# EasyEDA Pro project ProPrj_Y车Y形板_2025-09-30.epro, schematic Schematic10
Board Name: XW; Create Date: 2025-05-23; Page Name: P1; Project Name: Y车Y形板; Schematic Name: Schematic10; Update Date: 2025-05-23; Company: 嘉立创EDA; Page Size: A4; Version: V1.0
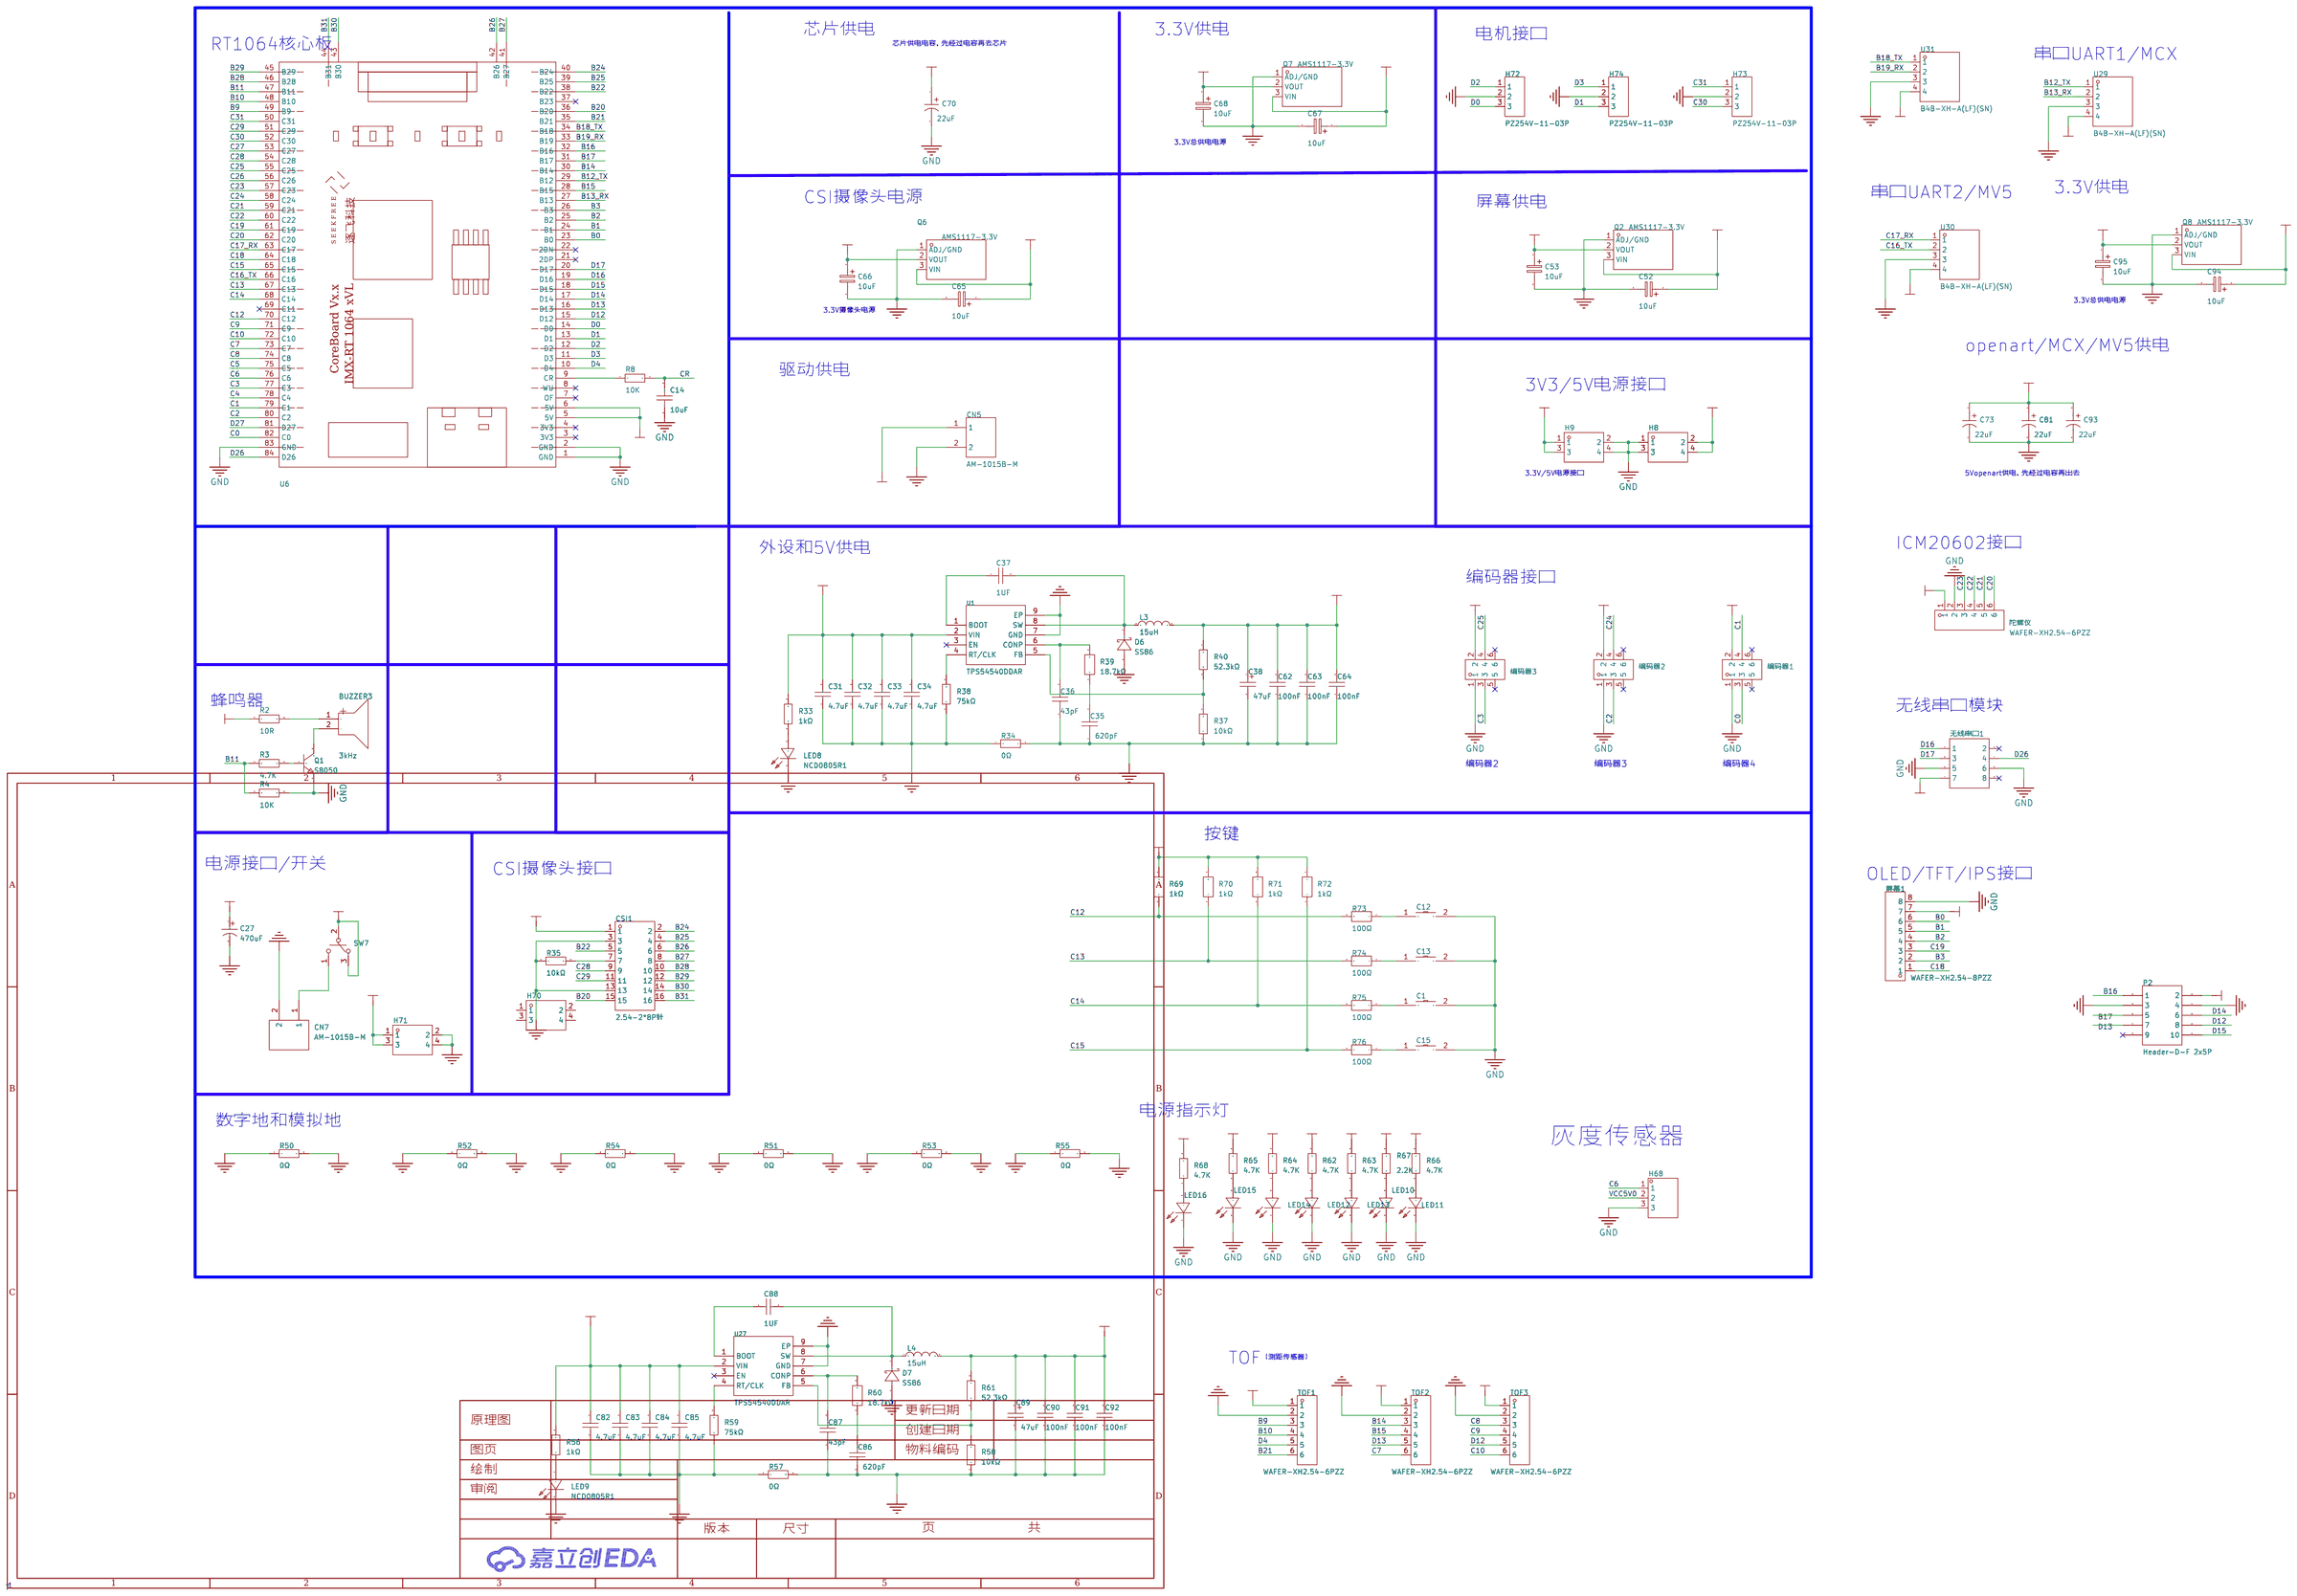
[diagram p0: schematic sheet]

## Parts
BUZZER3  3kHz  [BUZ-TH_BD9.0-P5.00-D0.6-FD]
C1  TS-1101-C-W  [SW-SMD_L6.0-W3.3-LS8.0]
C12  TS-1101-C-W  [SW-SMD_L6.0-W3.3-LS8.0]
C13  TS-1101-C-W  [SW-SMD_L6.0-W3.3-LS8.0]
C14  10uF  [C0805]
C15  TS-1101-C-W  [SW-SMD_L6.0-W3.3-LS8.0]
C27  470uF  [CAP-TH_BD10.0-P5.00-D1.0-FD]
C31  4.7uF  [C0805]
C32  4.7uF  [C0805]
C33  4.7uF  [C0805]
C34  4.7uF  [C0805]
C35  620pF  [C0805]
C36  43pF  [C0805]
C37  1UF  [C0805]
C38  47uF  [CAP-SMD_L3.5-W2.8-R-RD]
C52  10uF  [CAP-SMD_L3.5-W2.8-R-RD]
C53  10uF  [CAP-SMD_L3.5-W2.8-R-RD]
C62  100nF  [C0805]
C63  100nF  [C0805]
C64  100nF  [C0805]
C65  10uF  [CAP-SMD_L3.5-W2.8-R-RD]
C66  10uF  [CAP-SMD_L3.5-W2.8-R-RD]
C67  10uF  [CAP-SMD_L3.5-W2.8-R-RD]
C68  10uF  [CAP-SMD_L3.5-W2.8-R-RD]
C70  22uF  [CAP-SMD_L3.2-W1.6]
C73  22uF  [CAP-SMD_L3.2-W1.6]
C81  22uF  [CAP-SMD_L3.2-W1.6]
C82  4.7uF  [C0805]
C83  4.7uF  [C0805]
C84  4.7uF  [C0805]
C85  4.7uF  [C0805]
C86  620pF  [C0805]
C87  43pF  [C0805]
C88  1UF  [C0805]
C89  47uF  [CAP-SMD_L3.5-W2.8-R-RD]
C90  100nF  [C0805]
C91  100nF  [C0805]
C92  100nF  [C0805]
C93  22uF  [CAP-SMD_L3.2-W1.6]
C94  10uF  [CAP-SMD_L3.5-W2.8-R-RD]
C95  10uF  [CAP-SMD_L3.5-W2.8-R-RD]
CN5  AM-1015B-M  [CONN-TH_AM-1015B-M]
CN7  AM-1015B-M  [CONN-TH_AM-1015B-M]
CSI1  2.54-2*8P针  [HDR-TH_16P-P2.54-V-M-R2-C8-S2.54]
D6  SS86  [SMC_L6.9-W5.9-LS7.9-RD]
D7  SS86  [SMC_L6.9-W5.9-LS7.9-RD]
H8  -  [HDR-TH_4P-P2.54-V-M-R2-C2-S2.54-1]
H9  -  [HDR-TH_4P-P2.54-V-M-R2-C2-S2.54-1]
H68  77311-102-03LF  [HDR-TH_3P-P2.54-V-M-1]
H70  -  [HDR-TH_4P-P2.54-V-M-R2-C2-S2.54-1]
H71  -  [HDR-TH_4P-P2.54-V-M-R2-C2-S2.54-1]
H72  PZ254V-11-03P  [HDR-TH_3P-P2.54-V-M]
H73  PZ254V-11-03P  [HDR-TH_3P-P2.54-V-M]
H74  PZ254V-11-03P  [HDR-TH_3P-P2.54-V-M]
L3  15uH  [IND-SMD_L7.1-W6.6]
L4  15uH  [IND-SMD_L7.1-W6.6]
LED8  NCD0805R1  [LED0805-R-RD]
LED9  NCD0805R1  [LED0805-R-RD]
LED10  NCD0805R1  [LED0805-RD]
LED11  NCD0805R1  [LED0805-RD]
LED12  NCD0805R1  [LED0805-RD]
LED13  NCD0805R1  [LED0805-RD]
LED14  NCD0805R1  [LED0805-RD]
LED15  NCD0805R1  [LED0805-RD]
LED16  NCD0805R1  [LED0805-RD]
P2  Header-D-F 2x5P  [HDR2X5-F]
Q1  S8050  [SOT-23-3_L2.9-W1.3-P1.90-LS2.4-BR]
Q2  AMS1117-3.3V  [SOT-89-3_L4.5-W2.5-P1.50-LS4.2-BR]
Q6  AMS1117-3.3V  [SOT-89-3_L4.5-W2.5-P1.50-LS4.2-BR]
Q7  AMS1117-3.3V  [SOT-89-3_L4.5-W2.5-P1.50-LS4.2-BR]
Q8  AMS1117-3.3V  [SOT-89-3_L4.5-W2.5-P1.50-LS4.2-BR]
R2  10R  [R0805]
R3  4.7K  [R0805]
R4  10K  [R0805]
R8  10K  [R0805]
R33  1kΩ  [R0805]
R34  0Ω  [R0805]
R35  10kΩ  [R0603]
R37  10kΩ  [R0805]
R38  75kΩ  [R0805]
R39  18.7kΩ  [R0805]
R40  52.3kΩ  [R0805]
R50  0Ω  [R0805]
R51  0Ω  [R0805]
R52  0Ω  [R0805]
R53  0Ω  [R0805]
R54  0Ω  [R0805]
R55  0Ω  [R0805]
R56  1kΩ  [R0805]
R57  0Ω  [R0805]
R58  10kΩ  [R0805]
R59  75kΩ  [R0805]
R60  18.7kΩ  [R0805]
R61  52.3kΩ  [R0805]
R62  4.7K  [R0805]
R63  4.7K  [R0805]
R64  4.7K  [R0805]
R65  4.7K  [R0805]
R66  4.7K  [R0805]
R67  2.2K  [R0805]
R68  4.7K  [R0805]
R69  1kΩ  [R0805]
R70  1kΩ  [R0805]
R71  1kΩ  [R0805]
R72  1kΩ  [R0805]
R73  100Ω  [R0805]
R74  100Ω  [R0805]
R75  100Ω  [R0805]
R76  100Ω  [R0805]
SW7  MT-0-103-A101-M200-RS+PJ  [SW-TH_MT-0-103-A101-M200-RS]
TOF1  WAFER-XH2.54-6PZZ  [CONN-TH_XH2.54-6P]
TOF2  WAFER-XH2.54-6PZZ  [CONN-TH_XH2.54-6P]
TOF3  WAFER-XH2.54-6PZZ  [CONN-TH_XH2.54-6P]
U1  TPS54540DDAR  [SOIC-8_L4.9-W3.9-P1.27-LS6.0-BL-EP]
U6  -  [AUFE_RT1064]
U27  TPS54540DDAR  [SOIC-8_L4.9-W3.9-P1.27-LS6.0-BL-EP]
U29  B4B-XH-A(LF)(SN)  [CONN-TH_B4B-XH-A-LF-SN]
U30  B4B-XH-A(LF)(SN)  [CONN-TH_B4B-XH-A-LF-SN]
U31  B4B-XH-A(LF)(SN)  [CONN-TH_B4B-XH-A-LF-SN]
屏幕1  WAFER-XH2.54-8PZZ  [CONN-TH_8P-P2.50-XH2.54-8P]
无线串口1  -  [HDR-TH_8P-P2.54-V-F-R2-C4-S2.54-1]
编码器1  67997-206HLF  [HDR-TH_6P-P2.54-V-M-R2-C3-S2.54-1]
编码器2  67997-206HLF  [HDR-TH_6P-P2.54-V-M-R2-C3-S2.54-1]
编码器3  67997-206HLF  [HDR-TH_6P-P2.54-V-M-R2-C3-S2.54-1]
陀螺仪  WAFER-XH2.54-6PZZ  [CONN-TH_XH2.54-6P]

## Library data of the parts
BUZZER3 = HNB09A03: 驱动方式:有源(内含驱动线路);构造类型:电磁式;频率:3kHz;声压(SPL):85dB@10cm;; LCSC Part Name: 电磁式有源一体蜂鸣器HNB09A03; Supplier Part: C96102; Manufacturer: 华能; Supplier Footprint: 插件,D=9mm; JLCPCB Part Class: 扩展库; Datasheet: https://atta.szlcsc.com/upload/public/pdf/source/20170522/1495448326172.pdf; Supplier: LCSC; Oscillator Circuit: 有源(内含驱动线路); Technology Type: 电磁式; Operating Voltage: 1.5V~4.5V; Current Consumption: 30mA; Sound Pressure Level (SPL): 85dB@10cm; Diameter (φD): 9mm; Height: 5.5mm; Operating Temperature: -20℃~+70℃
C1 C12 C13 C15 = TS-1101-C-W: 触点电流:50mA;额定电压(DC):12V;绝缘电阻:-;电路结构:单刀单掷;安装方式:立贴;按钮形状:矩形按钮;按钮/盖帽颜色:白色;带灯:无;作用力:260gf;机械寿命:50000;工作温度:-30℃~+85℃;开关长度:6mm;开关宽度:3.6mm;开关高度:2.5mm;带支架:否;; LCSC Part Name: TS-1101-C-W 一型3*6*2.5有白ZD b拉伸白色按键 卷装; Supplier Part: C318938; Manufacturer: XKB Connectivity(中国星坤); Supplier Footprint: SMD; JLCPCB Part Class: Extended Part; Datasheet: https://atta.szlcsc.com/upload/public/pdf/source/20200227/C318938_C2E53B1EEDE37D980A33616AC086DE53.pdf; Supplier: LCSC; Contact Current: 50mA; Voltage Rating (DC): 12V; Circuit: 单刀单掷; Mounting Style: 立贴; Actuator Style: 矩形按钮; Actuator/Cap Color: 白色; With Lamp: 无; Operating Force: 260gf; Mechanical Life: 50000; Operating Temperature: -30℃~+85℃; Switch Length: 6mm; Switch Width: 3.6mm; Switch Height: 2.5mm; Strike Gundam: 否
C14 = CAP_0805: Supplier Footprint: 0805
C27 = KM477M050G20RR0VH2FP0: 容值:470uF;精度:±20%;额定电压:50V;电容体直径:10mm;电容体长度:20mm;脚间距:5mm;工作寿命:2000hrs@105℃;; LCSC Part Name: 470uF ±20% 50V; Supplier Part: C34642; Manufacturer: CX(承兴); Supplier Footprint: 直插,D10xL20mm; JLCPCB Part Class: Extended Part; Datasheet: https://atta.szlcsc.com/upload/public/pdf/source/20211027/06D6BA3719C264B639DC286D935D03EA.pdf; Supplier: LCSC; Tolerance: ±20%; Rated Voltage: 50V; φD: 10mm; L: 20mm; Lead Spacing: 5mm; Lifetime @ Temp: 2000hrs@105℃
C31-C34 C82-C85 = CL21A475KAQNNNE: 容值:4.7uF;精度:±10%;额定电压:25V;材质(温度系数):X5R;; LCSC Part Name: 4.7uF ±10% 25V; Supplier Part: C1779; Manufacturer: SAMSUNG(三星); Supplier Footprint: 0805; JLCPCB Part Class: 基础库; Datasheet: https://atta.szlcsc.com/upload/public/pdf/source/20160218/1457707763339.pdf; Supplier: LCSC; Tolerance: ±10%; Voltage Rated: 25V; Temperature Coefficient: X5R
C35 C86 = CC0805FRNPO9BN621: 容值:620pF;精度:±1%;额定电压:50V;材质(温度系数):NP0;; LCSC Part Name: 620pF ±1% 50V; Supplier Part: C541568; Manufacturer: YAGEO(国巨); Supplier Footprint: 0805; JLCPCB Part Class: 扩展库; Datasheet: https://atta.szlcsc.com/upload/public/pdf/source/20200615/C541568_5E136F40411BB8460285BCFF982D8614.pdf; Supplier: LCSC; Tolerance: ±1%; Voltage Rated: 50V; Temperature Coefficient: NP0
C36 C87 = 0805CG430J500NT: 容值:43pF;精度:±5%;额定电压:50V;材质(温度系数):C0G;; LCSC Part Name: 43pF ±5% 50V; Supplier Part: C502147; Manufacturer: FH(风华); Supplier Footprint: 0805; JLCPCB Part Class: 扩展库; Datasheet: https://atta.szlcsc.com/upload/public/pdf/source/20200305/C486355_26A10D38EF8C2A5C37091D0039909270.pdf; Supplier: LCSC; Tolerance: ±5%; Voltage Rated: 50V; Temperature Coefficient: C0G
C37 C88 = CC0805KRX7R9BB104: 容值:100nF;精度:±10%;额定电压:50V;材质(温度系数):X7R;; LCSC Part Name: 100nF ±10% 50V; Supplier Part: C49678; Manufacturer: YAGEO(国巨); Supplier Footprint: 0805; JLCPCB Part Class: 基础库; Datasheet: https://atta.szlcsc.com/upload/public/pdf/source/20180224/C181747_15194369449651363981.pdf; Supplier: LCSC; Tolerance: ±10%; Voltage Rated: 50V; Temperature Coefficient: X7R
C38 C89 = CA45-B010K476T: 容值:47uF;精度:±10%;额定电压:10V;等效串联电阻:1Ω@100kHz;; LCSC Part Name: 47uF ±10% 10V; Supplier Part: C123253; Manufacturer: 湘怡中元/湘江; Supplier Footprint: CASE-B-3528; JLCPCB Part Class: 扩展库; Datasheet: https://atta.szlcsc.com/upload/public/pdf/source/20181017/C123253_E44F021CD80332E438026884F943F9F2.pdf; Supplier: LCSC; Tolerance: ±10%; Rated Voltage: 10V; Equivalent Series Resistance(ESR): 1Ω@100kHz; Operating Temperature: -55℃~+125℃
C52 C53 C65-C68 C94 C95 = CA45-B-16V-10μF-K: 容值:10uF;精度:±10%;额定电压:16V;等效串联电阻:2.8Ω@100kHz;; LCSC Part Name: 10uF ±10% 16V; Supplier Part: C503899; Manufacturer: TORCH(火炬); Supplier Footprint: CASE-B-3528; JLCPCB Part Class: 扩展库; Datasheet: https://atta.szlcsc.com/upload/public/pdf/source/20200527/C503899_E68A547A52C2BA3860090FD06476D5DC.pdf; Supplier: LCSC; Tolerance: ±10%; Rated Voltage: 16V; Equivalent Series Resistance(ESR): 2.8Ω@100kHz; Operating Temperature: -55℃~+125℃
C62-C64 C90-C92 = 0805B104K500NT: 容值:100nF;精度:±10%;额定电压:50V;材质(温度系数):X7R;; LCSC Part Name: 100nF ±10% 50V; Supplier Part: C38141; Manufacturer: FH(风华); Supplier Footprint: 0805; JLCPCB Part Class: 扩展库; Datasheet: https://atta.szlcsc.com/upload/public/pdf/source/20200305/C486355_26A10D38EF8C2A5C37091D0039909270.pdf; Supplier: LCSC; Tolerance: ±10%; Voltage Rated: 50V; Temperature Coefficient: X7R
C70 C73 C81 C93 = CA45-A-16V-22uF-K: 容值:22uF;精度:±10%;额定电压:16V;等效串联电阻:6Ω@100kHz;; LCSC Part Name: 22uF ±10% 16V; Supplier Part: C782264; Manufacturer: CEC(振华新云); Supplier Footprint: CASE-A-3216; JLCPCB Part Class: 扩展库; Datasheet: https://atta.szlcsc.com/upload/public/pdf/source/20200909/C782264_D6D9C4EF3B25E81633C26A9294FBB820.pdf; Supplier: LCSC; Tolerance: ±10%; Rated Voltage: 16V; Equivalent Series Resistance(ESR): 6Ω@100kHz; Operating Temperature: -55℃~+125℃
CN5 CN7 = AM-1015B-M: 类别:-;类型1:-;; LCSC Part Name: AMASS(艾迈斯)电源连接器公头AM-1015B-M; Supplier Part: C90631; Manufacturer: AMASS(艾迈斯); JLCPCB Part Class: 扩展库; Datasheet: https://atta.szlcsc.com/upload/public/pdf/source/20161217/1481939174683.pdf; Supplier: LCSC; Brand: 艾迈斯; Type: T行插头; RatedVoltage: DC 500V; InterfaceType: 双公头; MetalMaterial: 铜镀金; InsulationMaterial: PA; RatedCurrent: 25A; RecommendedWireGauge: 12AWG; FlameRetardantGrade: UL94 V0; contact resistance: 0.45mΩ
CSI1 = 2.54-2*8P针_C779499: 圆针/方针:-;额定电流:-;额定电压:-;配合针长度:-;塑高:-;触头材质:-;; LCSC Part Name: 双排直插 2*8排针 2.54mm; Supplier Part: C779499; Manufacturer: BOOMELE(博穆精密); Supplier Footprint: 插件,P=2.54mm; JLCPCB Part Class: 扩展库; Datasheet: https://atta.szlcsc.com/upload/public/pdf/source/20221201/C605E3BE9C0F7226363017EFD1BDE852.pdf; Supplier: LCSC
D6 D7 = SS86: 二极管配置:独立式;正向压降(Vf):700mV@8A;直流反向耐压(Vr):60V;平均整流电流(Io):8A;; LCSC Part Name: 电压:60V 电流:8A; Supplier Part: C698827; Manufacturer: YANGJIE(扬杰); Supplier Footprint: SMC(DO-214AB); JLCPCB Part Class: 扩展库; Datasheet: https://atta.szlcsc.com/upload/public/pdf/source/20200709/C698826_5E937841B5131ACF209993117D465D40.pdf; Supplier: LCSC; Diode Configuration: 独立式; Forward Voltage (Vf@If): 700mV@8A; Reverse Voltage (Vr): 60V; Average Rectified Current (Io): 8A; Reverse Leakage Current (Ir): 200uA@60V
H8 H9 H70 H71 = HDR-M_2.54_2x2: Supplier Part: C160338; Supplier Footprint: 插件,P=2.54mm
H68 = 77311-102-03LF: 排数:单排;总PIN位数:-;间距:2.54mm;插针结构:-;行距:-;安装类型:直插;圆针/方针:方针;额定电流:-;额定电压:-;配合针长度:-;塑高:2.54mm;触头材质:磷青铜;触头镀层:-;颜色:黑色;; LCSC Part Name: 2.54mm 直插 方针; Supplier Part: C180248; Manufacturer: Amphenol; Supplier Footprint: 直插,P=2.54mm; JLCPCB Part Class: Extended Part; Datasheet: https://atta.szlcsc.com/upload/public/pdf/source/20180329/C180248_62E264527695F7ED58561BB828D45E42.pdf; Supplier: LCSC; Number of Rows: 单排; Pitch: 2.54mm; Mounting Type: 直插; Circluar Pins/Square Pins: 方针; Insulation Height: 2.54mm; Contact Material: 磷青铜; Color: 黑色
H72-H74 = PZ254V-11-03P: 插针结构:1x3P;间距:2.54mm;行距:-;圆针/方针:方针;安装方式:直插;排数:单排;总PIN位数:3P;额定电流:3A;额定电压:250V;配合针长度:6mm;塑高:2.5mm;端接针长度:3mm;工作温度:-40℃~+105℃;颜色:黑色;; LCSC Part Name: 1x3P 间距:2.54mm 方针 直插; Supplier Part: C2937625; Manufacturer: XFCN(兴飞); Supplier Footprint: 插件,P=2.54mm; JLCPCB Part Class: 扩展库; Datasheet: https://atta.szlcsc.com/upload/public/pdf/source/20200309/C492402_8335C3D49C4E4C618838D59BB1D024C1.pdf; Supplier: LCSC; Pin Structure: 1x3P; Pitch: 2.54mm; Circluar Pins/Square Pins: 方针; Mounting Type: 直插; Number of Rows: 单排; Number of Pins: 3P; Current Rating: 3A; Voltage Rating (Max): 250V; Length of Mating Pin: 6mm; Insulation Height: 2.5mm; Length of End Connection Pin: 3mm; Operating Temperature: -40℃~+105℃; Color: 黑色
L3 L4 = PSPMAQ0605H-150M-ANP: 电感值:15uH;精度:±20%;额定电流:3.5A;饱和电流(Isat):6A;; LCSC Part Name: 15uH ±20% 6A; Supplier Part: C726343; Manufacturer: PROD(谱罗德); Supplier Footprint: SMD,6.6x7.1mm; JLCPCB Part Class: 扩展库; Datasheet: https://atta.szlcsc.com/upload/public/pdf/source/20200923/C726334_6740F679044ED6FAED7178765ABA7BEE.pdf; Supplier: LCSC; Tolerance: ±20%; Rated Current: 3.5A; Saturation Current (Isat): 6A; DC Resistance (DCR): 87mΩ; Ratings: AEC-Q200
LED8 LED9 = NCD0805R1: 灯头类型:-;发光颜色:红色;正向电压(VF):1.6V~2.6V;功率:65mW;正向电流:20mA;主波长:615nm~630nm;二极管配置:独立二极管;透镜颜色:无色透明;色温:-;发光强度:67mcd~195mcd;发光角度:130°;载带方式:-;工作温度:-30℃~+85℃;; Supplier Part: C84256; Manufacturer: 国星光电; Supplier Footprint: 0805; JLCPCB Part Class: 基础库; Datasheet: https://atta.szlcsc.com/upload/public/pdf/source/20200820/C84256_F0A75A43B3EAD75808600A0514C76B99.pdf; Supplier: LCSC; Emitted Color: 红色; Forward Voltage (VF): 1.6V~2.6V; Power Dissipation: 65mW; Forward Current: 20mA; Dominant Wavelength: 615nm~630nm; Diode Configuration: 独立二极管; Lens Color: 无色透明; Luminous Intensity: 67mcd~195mcd; Viewing Angle: 130°; Operating Temperature: -30℃~+85℃
LED10-LED16 = NCD0805R1: 发光颜色:红灯;; LCSC Part Name: 红灯; Supplier Part: C84256; Manufacturer: 国星光电; Supplier Footprint: 0805; JLCPCB Part Class: Basic Part; Datasheet: https://atta.szlcsc.com/upload/public/pdf/source/20200820/C84256_F0A75A43B3EAD75808600A0514C76B99.pdf; Supplier: LCSC; Emitted Color: 红灯
P2 = Header-D-F 2x5P: Revision: V1.0
Q1 = S8050_C2762211: 晶体管类型:NPN;集射极击穿电压(Vceo):25V;集电极电流(Ic):500mA;功率(Pd):300mW;集电极-发射极饱和电压(VCE(sat)@Ic,Ib):600mV@500mA,50mA;直流电流增益(hFE@Ic,Vce):120@50mA,1V;特征频率(fT):150MHz;工作温度:-55℃~+150℃@(Tj);; Supplier Part: C2762211; Manufacturer: 晶导微电子; Supplier Footprint: SOT-23; JLCPCB Part Class: Extended Part; Datasheet: https://atta.szlcsc.com/upload/public/pdf/source/20210521/C2762211_5AC5D762C14CC7F013712CBEE509B0DC.pdf; Supplier: LCSC; Transistor Type: NPN; Collector-Emitter Breakdown Voltage (Vceo): 25V; Collector Current (Ic): 500mA; Power Dissipation (Pd): 300mW; Collector-Emitter Saturation Voltage (VCE(sat)@Ic,Ib): 600mV@500mA,50mA; DC Current Gain (hFE@Ic,Vce): 120@50mA,1V; Transition Frequency (fT): 150MHz; Operating Temperature: -55℃~+150℃@(Tj)
Q2 Q6-Q8 = AMS1117-3.3V_C5120796: 输出类型:固定;最大输入电压:18V;输出电压:3.3V;最大输出电流:1A;输出极性:正极;; LCSC Part Name: 输入18V 输出3.3V 1A; Supplier Part: C5120796; Manufacturer: MSKSEMI(美森科); Supplier Footprint: SOT-89; JLCPCB Part Class: 扩展库; Datasheet: https://atta.szlcsc.com/upload/public/pdf/source/20231123/6117526697EB8BF6175FDEEBA0877266.pdf; Supplier: LCSC; Output Type: 固定; Maximum Input Voltage: 18V; Output Voltage: 3.3V; MAX Output Current: 1A; Dropout Voltage: 1.4V@(1A); standby current: 12mA; Operating Temperature: 0℃~+125℃; Output Polarity: 正极; Number of Outputs: 1
R2-R4 R8 R34 R50-R55 R57 R62-R68 = Res_0805: Supplier Footprint: 0805
R33 R56 = 0805W8F1001T5E: 阻值:1kΩ;精度:±1%;功率:125mW;温度系数:±100ppm/℃;电阻类型:厚膜电阻;; LCSC Part Name: 1kΩ ±1% 125mW 厚膜电阻; Supplier Part: C17513; Manufacturer: UNI-ROYAL(厚声); Supplier Footprint: 0805; JLCPCB Part Class: 基础库; Datasheet: https://atta.szlcsc.com/upload/public/pdf/source/20200306/C422600_1E6D84923E4A46A82E41ADD87F860B5C.pdf; Supplier: LCSC; Tolerance: ±1%; Power(Watts): 125mW; Overload Voltage (Max): 150V; Temperature Coefficient: ±100ppm/℃; Type: 厚膜电阻; Operating Temperature Range: -55℃~+155℃
R35 = 0603WAF1002T5E: 电阻类型:厚膜电阻;阻值:10kΩ;精度:±1%;功率:100mW;最大工作电压:75V;温度系数:±100ppm/℃;; LCSC Part Name: 10kΩ ±1% 100mW 厚膜电阻; Supplier Part: C25804; Manufacturer: UNI-ROYAL(厚声); Supplier Footprint: 0603; JLCPCB Part Class: 基础库; Datasheet: https://atta.szlcsc.com/upload/public/pdf/source/20200306/C422600_1E6D84923E4A46A82E41ADD87F860B5C.pdf; Supplier: LCSC; Type: 厚膜电阻; Tolerance: ±1%; Power(Watts): 100mW; Overload Voltage (Max): 75V; Temperature Coefficient: ±100ppm/℃; Operating Temperature Range: -55℃~+155℃
R37 R58 = 0805W8F1002T5E_C17414: 阻值:10kΩ;精度:±1%;功率:125mW;温度系数:±100ppm/℃;电阻类型:厚膜电阻;; LCSC Part Name: 10kΩ ±1% 125mW 厚膜电阻; Supplier Part: C17414; Manufacturer: UNI-ROYAL(厚声); Manufacturer Part: 0805W8F1002T5E; Supplier Footprint: 0805; JLCPCB Part Class: 基础库; Datasheet: https://atta.szlcsc.com/upload/public/pdf/source/20200306/C422600_1E6D84923E4A46A82E41ADD87F860B5C.pdf; Supplier: LCSC; Tolerance: ±1%; Power(Watts): 125mW; Overload Voltage (Max): 150V; Temperature Coefficient: ±100ppm/℃; Type: 厚膜电阻; Operating Temperature Range: -55℃~+155℃
R38 R59 = 0805W8F7502T5E: 电阻类型:厚膜电阻;阻值:75kΩ;精度:±1%;功率:125mW;最大工作电压:150V;温度系数:±100ppm/℃;; LCSC Part Name: 75kΩ ±1% 125mW 厚膜电阻; Supplier Part: C17819; Manufacturer: UNI-ROYAL(厚声); Supplier Footprint: 0805; JLCPCB Part Class: 扩展库; Datasheet: https://atta.szlcsc.com/upload/public/pdf/source/20200306/C422600_1E6D84923E4A46A82E41ADD87F860B5C.pdf; Supplier: LCSC; Type: 厚膜电阻; Tolerance: ±1%; Power(Watts): 125mW; Overload Voltage (Max): 150V; Temperature Coefficient: ±100ppm/℃; Operating Temperature Range: -55℃~+155℃
R39 R60 R69-R76 = RC0805FR-0718K7L: 电阻类型:厚膜电阻;阻值:18.7kΩ;精度:±1%;功率:125mW;最大工作电压:150V;温度系数:±100ppm/℃;; LCSC Part Name: 厚膜电阻 18.7kΩ ±1% 125mW; Supplier Part: C273880; Manufacturer: YAGEO(国巨); Supplier Footprint: 0805; JLCPCB Part Class: 扩展库; Datasheet: https://atta.szlcsc.com/upload/public/pdf/source/20191125/C364360_EA870FADD46A2AD4DBE56DD50D360B3E.pdf; Supplier: LCSC; Type: 厚膜电阻; Tolerance: ±1%; Power(Watts): 125mW; Overload Voltage (Max): 150V; Temperature Coefficient: ±100ppm/℃; Operating Temperature Range: -55℃~+155℃
R40 R61 = RS-05K5232FT: 电阻类型:厚膜电阻;阻值:52.3kΩ;精度:±1%;功率:125mW;最大工作电压:150V;温度系数:±100ppm/℃;; LCSC Part Name: 厚膜电阻 52.3kΩ ±1% 125mW; Supplier Part: C322506; Manufacturer: FH(风华); Supplier Footprint: 0805; JLCPCB Part Class: 扩展库; Datasheet: https://atta.szlcsc.com/upload/public/pdf/source/20140616/1457707091974.pdf; Supplier: LCSC; Type: 厚膜电阻; Tolerance: ±1%; Power(Watts): 125mW; Overload Voltage (Max): 150V; Temperature Coefficient: ±100ppm/℃; Operating Temperature Range: -55℃~+155℃
SW7 = MT-0-103-A101-M200-RS+PJ: 额定电流:5A;额定电压(AC):125V;电路结构:单刀双掷;钮柄形状:圆柱钮柄;引脚样式:焊片;安装方式:直插;工作温度:-25℃~+85℃;开关长度:13mm;开关宽度:8mm;开关高度:28.6mm;; LCSC Part Name: 小型钮子三脚三档(五件套); Supplier Part: C1788493; Manufacturer: YUEN FUNG(源丰); Supplier Footprint: 插件; JLCPCB Part Class: Extended Part; Datasheet: https://atta.szlcsc.com/upload/public/pdf/source/20201225/C1788493_608759AD4D4A20FF90A03E3E3321FD91.pdf; Supplier: LCSC; Contact Current: 5A; Voltage Rating (AC): 125V; Circuit: 单刀双掷; Actuator Type: 圆柱钮柄; Pin Style: 焊片; Mounting Style: 直插; Operating Temperature: -25℃~+85℃; Switch Length: 13mm; Switch Width: 8mm; Switch Height: 28.6mm
TOF1-TOF3 陀螺仪 = WAFER-XH2.54-6PZZ: 插针结构:1x6P;间距:2.54mm;安装方式:直插;总PIN数:6P;排数:1;每排PIN数:6;额定电流:2A;工作温度范围:-25℃~+85℃;; LCSC Part Name: XH 2.54mm 1x6P 直插; Supplier Part: C5359634; Manufacturer: XUNPU(讯普); Supplier Footprint: 插件,P=2.54mm; JLCPCB Part Class: 扩展库; Datasheet: https://atta.szlcsc.com/upload/public/pdf/source/20230221/5D6483F9C7001DB87CFCFC787E1DC139.pdf; Supplier: LCSC; Pins Structure: 1x6P; Pitch: 2.54mm; Mounting Style: 直插; Number of Pins: 6P; Number of Rows: 1; Number of PINs Per Row: 6; Current Rating (Max): 2A; Operating Temperature Range: -25℃~+85℃
U1 U27 = TPS54540DDAR: 功能类型:降压型;输出类型:可调;输入电压:4.5V~42V;输出电压:800mV~41.1V;输出电流(最大值):5A;; Supplier Part: C95286; Manufacturer: TI(德州仪器); Supplier Footprint: SOP-8-EP; JLCPCB Part Class: 扩展库; Datasheet: https://www.ti.com/cn/lit/gpn/tps54540; Supplier: LCSC; Function: 降压型; Synchronous Rectification: 否; Output Type: 可调; Number of Outputs: 1; Topology: 降压式; Input Voltage: 4.5V~42V; Output Voltage: 800mV~41.1V; Output Current (Max): 5A; Switching Frequency: 2.5MHz; Operating Temperature: -40℃~+150℃@(TJ)
U6 = RT1064
U29-U31 = B4B-XH-A(LF)(SN): 插针结构:1x4P;间距:2.5mm;安装方式:直插;参考系列:XH;总PIN数:4P;排数:1;每排PIN数:4;行距:-;额定电流:3A;触头材质:黄铜;触头镀层:锡;工作温度范围:-25℃~+85℃;; LCSC Part Name: 1x4P 间距:2.5mm 直插 系列:XH; Supplier Part: C144395; Manufacturer: JST; Supplier Footprint: 插件,P=2.5mm; JLCPCB Part Class: 扩展库; Datasheet: https://atta.szlcsc.com/upload/public/pdf/source/20180928/C265283_F9DFEEBDB2CF642B6BDFAB4B77BD2680.pdf; Supplier: LCSC; Pins Structure: 1x4P; Pitch: 2.5mm; Mounting Style: 直插; Reference Series: XH; Number of Pins: 4P; Number of Rows: 1; Number of PINs Per Row: 4; Current Rating (Max): 3A; Contact Material: 黄铜; Contact Plating: 锡; Operating Temperature Range: -25℃~+85℃; Rated Voltage (Max): 250V; Plastic Material: PA66; Flame Retardant Rating: UL94V-0; Supplementary Features: 打K脚; Z-Height of the Board: 7mm; X-Length of Bottom Edge on Board (Spacing Line): 12.4mm; Y-Width of Bottom Edge on Board: 5.75mm
屏幕1 = WAFER-XH2.54-8PZZ: 插针结构:1x8P;间距:2.54mm;安装方式:直插;总PIN数:8P;排数:1;每排PIN数:8;额定电流:2A;工作温度范围:-25℃~+85℃;; LCSC Part Name: XH 2.54mm 1x8P 直插; Supplier Part: C5359636; Manufacturer: XUNPU(讯普); Supplier Footprint: 插件,P=2.54mm; JLCPCB Part Class: 扩展库; Datasheet: https://atta.szlcsc.com/upload/public/pdf/source/20230221/5D6483F9C7001DB87CFCFC787E1DC139.pdf; Supplier: LCSC; Pins Structure: 1x8P; Pitch: 2.54mm; Mounting Style: 直插; Number of Pins: 8P; Number of Rows: 1; Number of PINs Per Row: 8; Current Rating (Max): 2A; Operating Temperature Range: -25℃~+85℃
无线串口1 = HDR-F_2.54_2x4: Supplier Part: C92271; Supplier Footprint: 插件
编码器1-编码器3 = 67997-206HLF: 排数:双排;总PIN位数:-;间距:2.54mm;插针结构:-;行距:2.54mm;安装类型:直插;圆针/方针:方针;额定电流:-;额定电压:-;配合针长度:-;塑高:2.54mm;触头材质:磷青铜;触头镀层:-;颜色:黑色;; LCSC Part Name: 2.54mm 直插 方针; Supplier Part: C236051; Manufacturer: Amphenol; Supplier Footprint: 插件,P=2.54mm; JLCPCB Part Class: Extended Part; Datasheet: https://atta.szlcsc.com/upload/public/pdf/source/20180628/C236051_0392958A7E48808CEC9642DF7CCB05DE.pdf; Supplier: LCSC; Number of Rows: 双排; Pitch: 2.54mm; Row Spacing: 2.54mm; Mounting Type: 直插; Circluar Pins/Square Pins: 方针; Insulation Height: 2.54mm; Contact Material: 磷青铜; Color: 黑色

## Nets
3V3: C68.1 C95.1 H8.2 H8.4 Q7.2(VOUT) Q8.2(VOUT) R2.1 R69.2 R70.2 R71.2 R72.2 编码器1.2 编码器2.2 编码器3.2
3V31: C53.1 Q2.2(VOUT) R67.2 屏幕1.7
GND: C1.2 C12.2 C13.2 C14.1 C15.2 C35.1 C36.1 C38.2 C52.2 C53.2 C62.1 C63.1 C64.1 C65.2 C66.2 C67.2 C68.2 C70.2 C73.2 C81.2 C86.1 C87.1 C89.2 C90.1 C91.1 C92.1 C93.2 C94.2 C95.2 CSI1.3 CSI1.13 D6.2(A) D7.2(A) H8.1 H8.3 H9.2 H9.4 H68.3 H72.2 H73.2 H74.2 LED10.1(-) LED11.1(-) LED12.1(-) LED13.1(-) LED14.1(-) LED15.1(-) LED16.1(-) P2.3 P2.4 Q1.2(E) Q2.1(ADJ/GND) Q6.1(ADJ/GND) Q7.1(ADJ/GND) Q8.1(ADJ/GND) R4.2 R34.2 R35.1 R37.1 R50.2 R51.2 R52.2 R53.2 R54.2 R55.2 R57.2 R58.1 TOF1.2 TOF2.2 TOF3.2 U1.7(GND) U1.9(EP) U6.1(GND) U6.2(GND) U6.83(GND) U27.7(GND) U27.9(EP) U29.3 U30.3 U31.3 屏幕1.8 无线串口1.5 无线串口1.6 编码器1.1 编码器2.1 编码器3.1 陀螺仪.2
GNDBAT: C27.2 C31.1 C32.1 C33.1 C34.1 C82.1 C83.1 C84.1 C85.1 CN5.2 CN7.2 H71.2 H71.4 LED8.2(-) LED9.2(-) R34.1 R38.1 R50.1 R51.1 R52.1 R53.1 R54.1 R55.1 R57.1 R59.1
VCC5V: C38.1 C52.1 C62.2 C63.2 C64.2 C65.1 C67.1 C70.1 C73.1 C81.1 C93.1 C94.1 H9.1 H9.3 L3.2 P2.2 Q2.3(VIN) Q6.3(VIN) Q7.3(VIN) Q8.3(VIN) R40.1 R62.2 R63.2 R64.2 R65.2 R68.2 U6.5(5V) U6.6(5V) U29.4 U30.4 U31.4 无线串口1.7 陀螺仪.1
VCC5V0: C89.1 C90.2 C91.2 C92.2 H68.2 L4.2 R61.1 R66.2 TOF1.1 TOF2.1 TOF3.1
VCCBAT: C27.1 C31.2 C32.2 C33.2 C34.2 C82.2 C83.2 C84.2 C85.2 CN5.1 H71.1 H71.3 R33.2 R56.2 SW7.2 SW7.3 U1.2(VIN) U27.2(VIN)
B0: U6.23(B0) 屏幕1.6
B1: U6.24(B1) 屏幕1.5
B2: U6.25(B2) 屏幕1.4
B3: U6.26(B3) 屏幕1.2
B9: TOF1.3 U6.49(B9)
B10: TOF1.4 U6.48(B10)
B11: R3.1 R4.1 U6.47(B11)
B12_TX: U6.29(B12) U29.1
B13_RX: U6.27(B13) U29.2
B14: TOF2.3 U6.30(B14)
B15: TOF2.4 U6.28(B15)
B16: P2.1 U6.32(B16)
B17: P2.5 U6.31(B17)
B18_TX: U6.34(B18) U31.1
B19_RX: U6.33(B19) U31.2
B20: CSI1.15 U6.36(B20)
B21: TOF1.6 U6.35(B21)
B22: CSI1.5 U6.38(B22)
B24: CSI1.2 U6.40(B24)
B25: CSI1.4 U6.39(B25)
B26: CSI1.6 U6.42(B26)
B27: CSI1.8 U6.41(B27)
B28: CSI1.10 U6.46(B28)
B29: CSI1.12 U6.45(B29)
B30: CSI1.14 U6.43(B30)
B31: CSI1.16 U6.44(B31)
C0: U6.82(C0) 编码器1.3
C1: U6.79(C1) 编码器1.4
C2: U6.80(C2) 编码器2.3
C3: U6.77(C3) 编码器3.3
C4: U6.78(C4)
C5: U6.75(C5)
C6: H68.1 U6.76(C6)
C7: TOF2.6 U6.73(C7)
C8: TOF3.3 U6.74(C8)
C9: TOF3.4 U6.71(C9)
C10: TOF3.6 U6.72(C10)
C12: R69.1 R73.2 U6.70(C12)
C13: R70.1 R74.2 U6.67(C13)
C14: R71.1 R75.2 U6.68(C14)
C15: R72.1 R76.2 U6.65(C15)
C16_TX: U6.66(C16) U30.2
C17_RX: U6.63(C17) U30.1
C18: U6.64(C18) 屏幕1.1
C19: U6.61(C19) 屏幕1.3
C20: U6.62(C20) 陀螺仪.6
C21: U6.59(C21) 陀螺仪.5
C22: U6.60(C22) 陀螺仪.4
C23: U6.57(C23) 陀螺仪.3
C24: U6.58(C24) 编码器2.4
C25: U6.55(C25) 编码器3.4
C26: U6.56(C26)
C27: U6.53(C27)
C28: CSI1.9 U6.54(C28)
C29: CSI1.11 U6.51(C29)
C30: H73.3 U6.52(C30)
C31: H73.1 U6.50(C31)
CR: C14.2 R8.2
CSI-3V3: C66.1 CSI1.1 Q6.2(VOUT)
D0: H72.3 U6.14(D0)
D1: H74.3 U6.13(D1)
D2: H72.1 U6.12(D2)
D3: H74.1 U6.11(D3)
D4: TOF1.5 U6.10(D4)
D12: P2.8 TOF3.5 U6.15(D12)
D13: P2.7 TOF2.5 U6.16(D13)
D14: P2.6 U6.17(D14)
D15: P2.10 U6.18(D15)
D16: U6.19(D16) 无线串口1.1
D17: U6.20(D17) 无线串口1.3
D26: U6.84(D26) 无线串口1.4
D27: U6.81(D27)
$1N5765: Q1.1(B) R3.2
$1N5766: BUZZER3.2(-) Q1.3(C)
$1N5940: BUZZER3.1(+) R2.2
$1N5970: CSI1.7 R35.2
$1N5984: R38.2 U1.4(RT/CLK)
$1N5985: C37.1 U1.1(BOOT)
$1N5986: C37.2 D6.1(C) L3.1 U1.8(SW)
$1N5987: C36.2 R39.2 U1.6(CONP)
$1N5988: C35.2 R39.1
$1N5989: R37.2 R40.2 U1.5(FB)
$1N6012: R8.1 U6.9(CR)
$1N6034: LED8.1(+) R33.1
$1N6099: R59.2 U27.4(RT/CLK)
$1N6100: C88.1 U27.1(BOOT)
$1N6101: C88.2 D7.1(C) L4.1 U27.8(SW)
$1N6102: C87.2 R60.2 U27.6(CONP)
$1N6103: C86.2 R60.1
$1N6104: R58.2 R61.2 U27.5(FB)
$1N6110: LED9.1(+) R56.1
$1N6112: LED12.2(+) R62.1
$1N6115: LED13.2(+) R63.1
$1N6120: LED14.2(+) R64.1
$1N6124: LED15.2(+) R65.1
$1N6125: LED11.2(+) R66.1
$1N6127: LED10.2(+) R67.1
$1N9649: LED16.2(+) R68.1
$1N16320: CN7.1 SW7.1
Net-(C1-1): C1.1 R75.1
Net-(C12-1): C12.1 R73.1
Net-(C13-1): C13.1 R74.1
Net-(C15-1): C15.1 R76.1

Not connected (* = marked no-connect by the designer): H70 1 2 3 4; P2 9*; U1 3(EN)*; U6 3(3V3)* 4(3V3)* 7(OF)* 8(WU)* 21(2DP)* 22(2DN)* 37(B23)* 69(C11)*; U27 3(EN)*; 无线串口1 2* 8*; 编码器1 5* 6*; 编码器2 5* 6*; 编码器3 5* 6*

## Notes on the sheet
- 芯片供电
- 芯片供电电容，先经过电容再去芯片
- 3.3V供电
- 电机接口
- RT1064核心板
- 串口UART1/MCX
- 3.3V总供电电源
- 3.3V供电
- CSI摄像头电源
- 屏幕供电
- 串口UART2/MV5
- 3.3V总供电电源
- 3.3V摄像头电源
- openart/MCX/MV5供电
- 驱动供电
- 3V3/5V电源接口
- 3.3V/5V电源接口
- 5Vopenart供电，先经过电容再出去
- 外设和5V供电
- ICM20602接口
- 编码器接口
- 蜂鸣器
- 无线串口模块
- 编码器2
- 编码器3
- 编码器4
- 按键
- 电源接口/开关
- CSI摄像头接口
- OLED/TFT/IPS接口
- 电源指示灯
- 数字地和模拟地
- 灰度传感器
- TOF
- （测距传感器）
